# EAGLE design cyrf6936-bob (EAGLE 6.4)
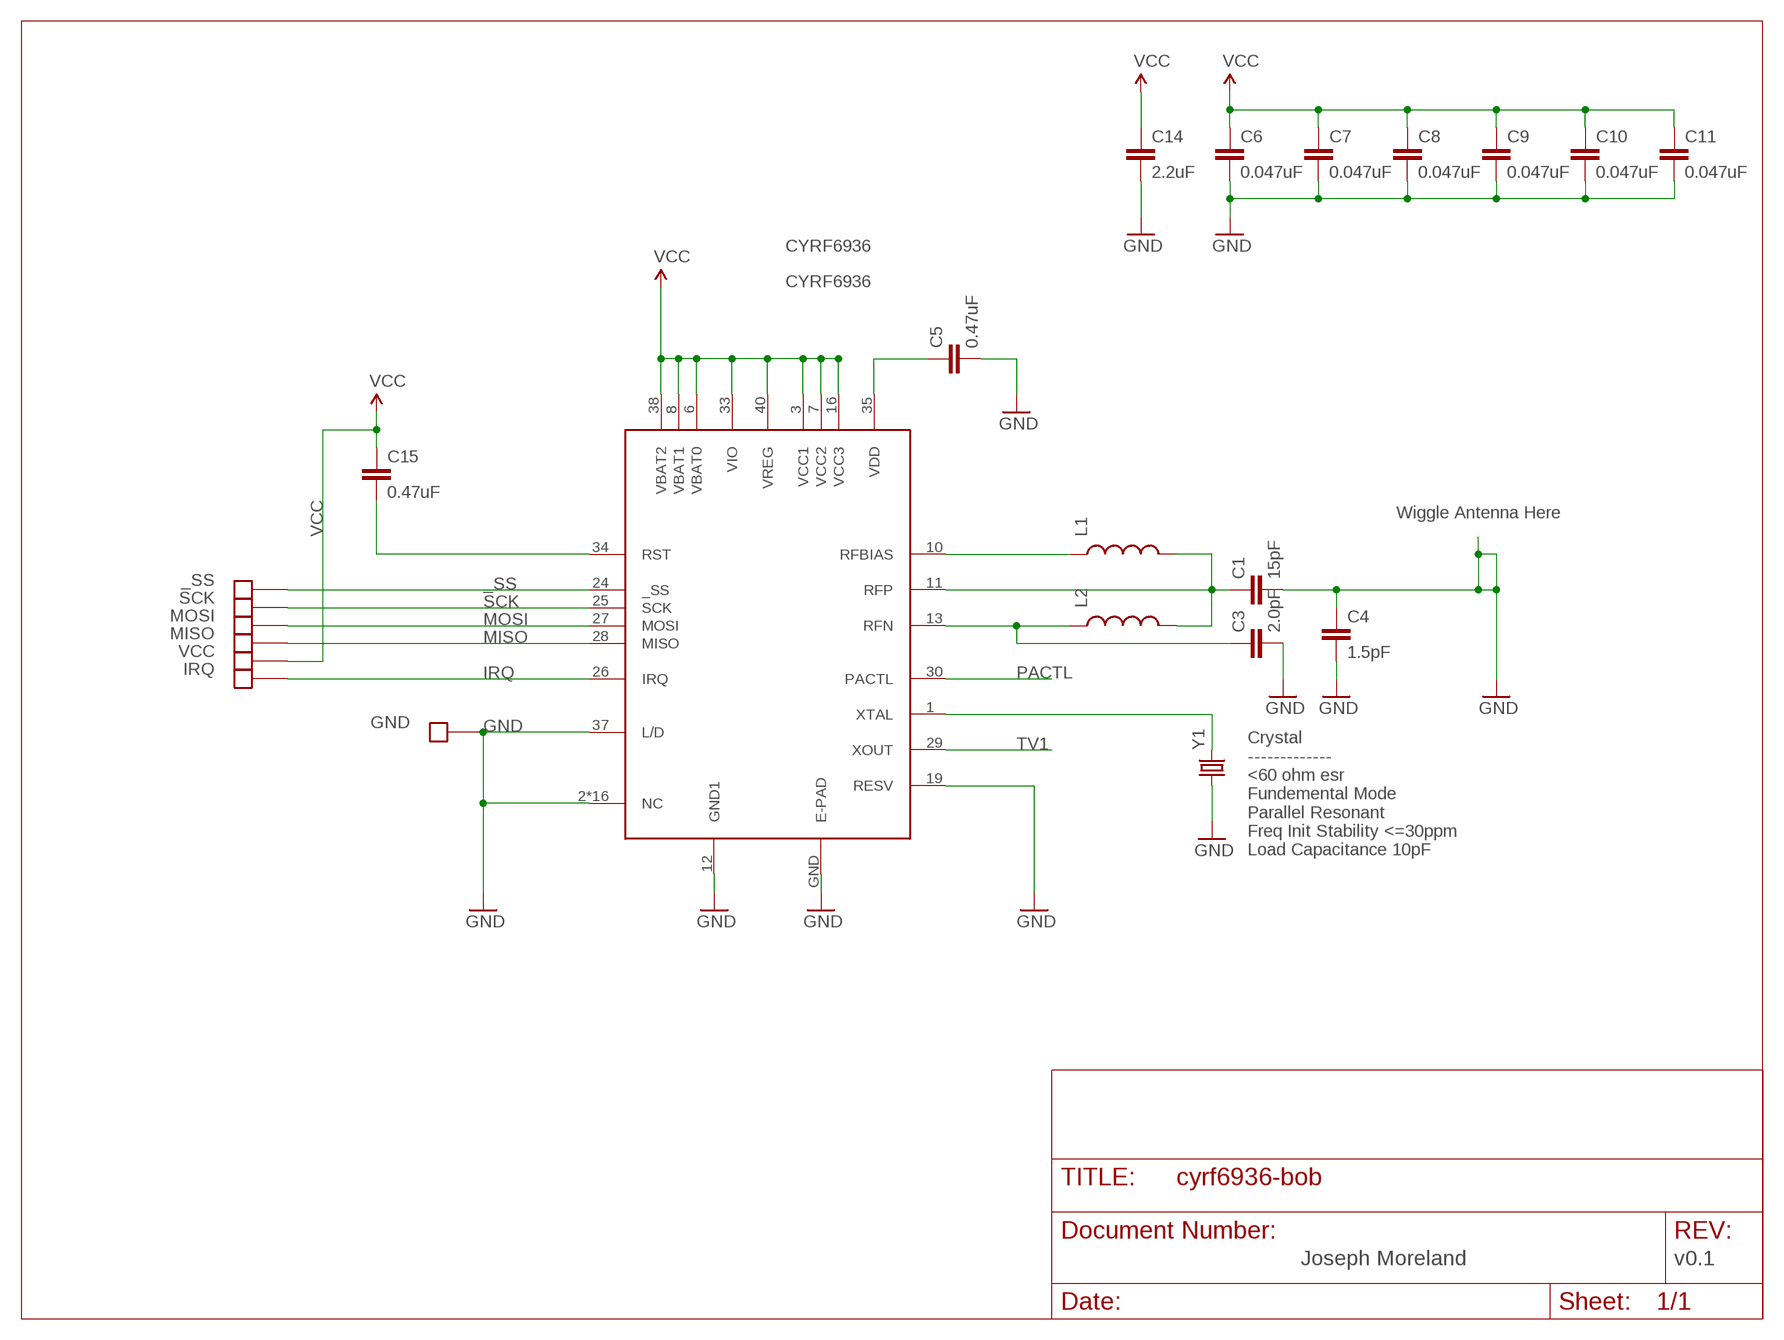
[diagram p0: schematic, sheet 1]

## Parts
_SS  SOLDER_PAD  [SOLDER_PAD]
C1  15pF  CAP0402-CAP  [0402-CAP]
C3  2.0pF  CAP0402-CAP  [0402-CAP]
C4  1.5pF  CAP0402-CAP  [0402-CAP]
C5  0.47uF  CAP0402-CAP  [0402-CAP]
C6  0.047uF  CAP0402-CAP  [0402-CAP]
C7  0.047uF  CAP0402-CAP  [0402-CAP]
C8  0.047uF  CAP0402-CAP  [0402-CAP]
C9  0.047uF  CAP0402-CAP  [0402-CAP]
C10  0.047uF  CAP0402-CAP  [0402-CAP]
C11  0.047uF  CAP0402-CAP  [0402-CAP]
C14  2.2uF  CAP0805  [0805]
C15  0.47uF  CAP0402-CAP  [0402-CAP]
CYRF6936  CYRF6936  [QFN40]
GND  SOLDER_PAD  [SOLDER_PAD]
IRQ  SOLDER_PAD  [SOLDER_PAD]
L1  INDUCTOR0603  [0603]
L2  INDUCTOR0402  [C0402]
MISO  SOLDER_PAD  [SOLDER_PAD]
MOSI  SOLDER_PAD  [SOLDER_PAD]
SCK  SOLDER_PAD  [SOLDER_PAD]
VCC  SOLDER_PAD  [SOLDER_PAD]
Y1  CRYSTAL5X3  [CRYSTAL-SMD-5X3]

## Nets
_SS: _SS.SPAD(NET) CYRF6936.24(_SS)
GND: C1.2 C3.2 C4.1 C4.2 C5.2 C6.2 C7.2 C8.2 C9.2 C10.2 C11.2 C14.2 CYRF6936.2(NC) CYRF6936.4(NC) CYRF6936.5(NC) CYRF6936.9(NC) CYRF6936.12(GND1) CYRF6936.14(NC) CYRF6936.15(NC) CYRF6936.17(NC) CYRF6936.18(NC) CYRF6936.19(RESV) CYRF6936.20(NC) CYRF6936.21(NC) CYRF6936.22(NC) CYRF6936.23(NC) CYRF6936.31(NC) CYRF6936.32(NC) CYRF6936.36(NC) CYRF6936.37(L/D) CYRF6936.39(NC) CYRF6936.GND(E-PAD) GND.SPAD(NET) Y1.1
IRQ: CYRF6936.26(IRQ) IRQ.SPAD(NET)
MISO: CYRF6936.28(MISO) MISO.SPAD(NET)
MOSI: CYRF6936.27(MOSI) MOSI.SPAD(NET)
N$2: CYRF6936.1(XTAL) Y1.3
PACTL: CYRF6936.30(PACTL)
RFBIAS: CYRF6936.10(RFBIAS) L1.1
RFN: C3.1 CYRF6936.13(RFN) L2.1
RFP: C1.1 CYRF6936.11(RFP) L1.2 L2.2
RST: C15.2 CYRF6936.34(RST)
SCK: CYRF6936.25(SCK) SCK.SPAD(NET)
TV1: CYRF6936.29(XOUT)
VCC: C6.1 C7.1 C8.1 C9.1 C10.1 C11.1 C14.1 C15.1 CYRF6936.3(VCC1) CYRF6936.6(VBAT0) CYRF6936.7(VCC2) CYRF6936.8(VBAT1) CYRF6936.16(VCC3) CYRF6936.33(VIO) CYRF6936.38(VBAT2) CYRF6936.40(VREG) VCC.SPAD(NET)
VDD: C5.1 CYRF6936.35(VDD)

## Notes on the sheet
- Wiggle Antenna Here
- Crystal
  -------------
  <60 ohm esr
  Fundemental Mode
  Parallel Resonant
  Freq Init Stability <=30ppm
  Load Capacitance 10pF
- Joseph Moreland | v0.1

## Library data of the parts
_SS GND IRQ MISO MOSI SCK VCC = JCM:SOLDER_PAD
C1 = SparkFun-Passives:CAP: Capacitor Standard 0603 ceramic capacitor, and 0.1" leaded capacitor.; PARTNO: C0402C150J5GACTU; VOLT: 50
C3 = SparkFun-Passives:CAP: Capacitor Standard 0603 ceramic capacitor, and 0.1" leaded capacitor.; PARTNO: C0402C209C5GACTU; VOLT: 50
C4 = SparkFun-Passives:CAP: Capacitor Standard 0603 ceramic capacitor, and 0.1" leaded capacitor.; PARTNO: C0402C159B5GACTU; VOLT: 50
C5 C15 = SparkFun-Passives:CAP: Capacitor Standard 0603 ceramic capacitor, and 0.1" leaded capacitor.; PARTNO: GRM155R60J474KE19D; VOLT: 6.3
C6-C11 = SparkFun-Passives:CAP: Capacitor Standard 0603 ceramic capacitor, and 0.1" leaded capacitor.; PARTNO: 0402YD473KAT2A
C14 = SparkFun-Passives:CAP: Capacitor Standard 0603 ceramic capacitor, and 0.1" leaded capacitor.; PARTNO: GRM21BR71A225KA01L
CYRF6936 = JCM:CYRF6936; PARTNO: CYRF6936B-40LTXC
L1 = SparkFun-Passives:INDUCTOR: Inductors Basic Inductor/Choke - 0603 and 1206. Footprints are not proven and vary greatly between part numbers.; PARTNO: ELJ-RE22NGFA
L2 = SparkFun-Passives:INDUCTOR: Inductors Basic Inductor/Choke - 0603 and 1206. Footprints are not proven and vary greatly between part numbers.; PARTNO: ELJ-RF1N8DFB
Y1 = SparkFun-FreqCtrl:CRYSTAL: Various standard crystals. Proven footprints. Spark Fun Electronics SKU : COM-00534; PARTNO: 7B-12.000MEEQ-T

## Board
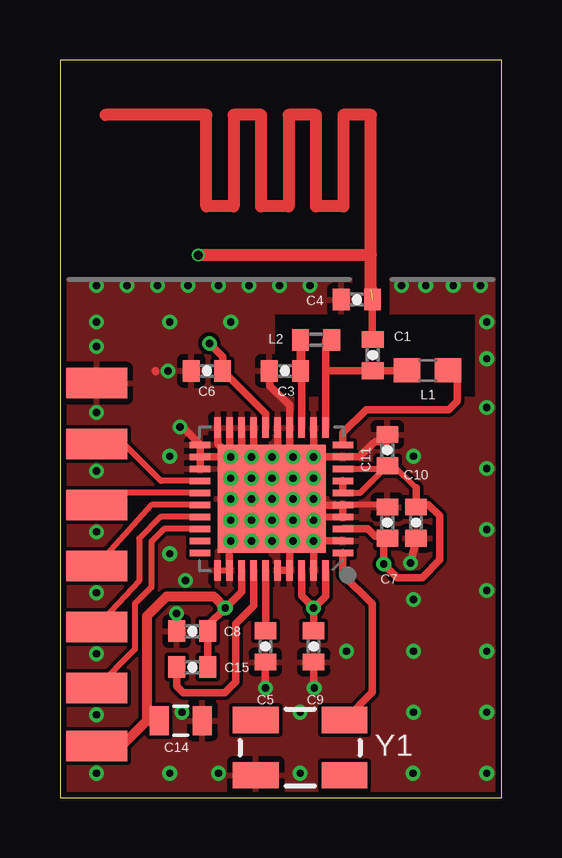
[diagram p1: board, top side]
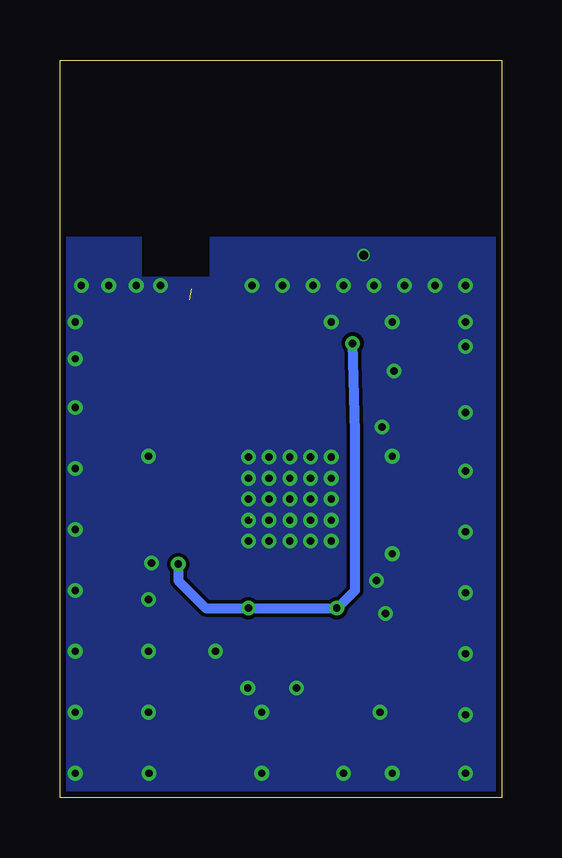
[diagram p2: board, bottom side, seen from below]

Size 18.41 x 30.73 mm. Coordinates in mm from the lower left corner, seen from the top.
Outline: 0,0 18.41,0 18.41,30.73 0,30.73 0,0
Copper layers (1*16): Top 0.035mm / dielectric 1.5mm / Bottom 0.035mm
Design rules "Fusion_eagle_rule_v1.1-JCM-restring *": minimum track width 6mil, minimum drill 12mil, track to track 6mil, track to pad 6mil, pad to pad 6mil, via to via 6mil, smd to smd 0mil, copper to edge 10mil, drill to drill 10mil, minimum pad ring 10mil, minimum via ring 2mil, stop-mask expansion 2mil, vias tented up to drill 100mil, thermal gap 10mil
tRestrict: area 9,16.7 to 17.3,20.1; area 12.2,20.1 to 13.7,21.8
bRestrict: area 12.2,21.7 to 15,23.4

### Footprints (pad centres in the part's own frame; a part is rotated, then mirrored left to right if it is on the bottom)
SOLDER_PAD = smd 2.54 x 1.27: SPAD 0,0
0402-CAP = smd 0.7 x 0.9: 1 -0.65,0; 2 0.65,0
0805 = smd 0.8 x 1.2: 1 -0.9,0; 2 0.9,0
QFN40 = smd 0.28 x 0.85: 1 -2.25,-2.975; 2 -1.75,-2.975; 3 -1.25,-2.975; 4 -0.75,-2.975; 5 -0.25,-2.975; 6 0.25,-2.975; 7 0.75,-2.975; 8 1.25,-2.975; 9 1.75,-2.975; 10 2.25,-2.975; 21 2.25,2.975; 22 1.75,2.975; 23 1.25,2.975; 24 0.75,2.975; 25 0.25,2.975; 26 -0.25,2.975; 27 -0.75,2.975; 28 -1.25,2.975; 29 -1.75,2.975; 30 -2.25,2.975 | smd 0.85 x 0.28: 11 2.975,-2.25; 12 2.975,-1.75; 13 2.975,-1.25; 14 2.975,-0.75; 15 2.975,-0.25; 16 2.975,0.25; 17 2.975,0.75; 18 2.975,1.25; 19 2.975,1.75; 20 2.975,2.25; 31 -2.975,2.25; 32 -2.975,1.75; 33 -2.975,1.25; 34 -2.975,0.75; 35 -2.975,0.25; 36 -2.975,-0.25; 37 -2.975,-0.75; 38 -2.975,-1.25; 39 -2.975,-1.75; 40 -2.975,-2.25 | smd 4.5 x 4.5: GND 0,0
0603 = smd 1.1 x 1: 1 -0.85,0; 2 0.85,0
C0402 = smd 0.7 x 0.9: 1 -0.65,0; 2 0.65,0
CRYSTAL-SMD-5X3 = smd 1.9 x 1.1: 1 -1.85,-1.15; 2 1.85,-1.15; 3 1.85,1.15; 4 -1.85,1.15

### Placement (x,y rotation side)
_SS  1.52,14.73 0 top
C1  13.03,18.44 90 top
C3  9.37,17.78 180 top
C4  12.37,20.75 180 top
C5  8.56,6.3 270 top
C6  6.12,17.78 180 top
C7  13.64,11.46 90 top
C8  5.51,6.93 180 top
C9  10.57,6.3 270 top
C10  14.83,11.46 270 top
C11  13.64,14.48 90 top
C14  5.03,3.2 0 top
C15  5.51,5.44 180 top
CYRF6936  8.81,12.45 90 top
GND  1.52,17.27 0 top
IRQ  1.52,9.65 0 top
L1  15.32,17.81 180 top
L2  10.67,19.08 0 top
MISO  1.52,4.57 0 top
MOSI  1.52,7.11 0 top
SCK  1.52,12.19 0 top
VCC  1.52,2.16 0 top
Y1  10.01,2.08 0 top

### Tracks (layer width: path | path; a pad name or v marks a point on that pad's centre or on a via)
_SS
  Top 0.254: CYRF6936.24 4.2,13.2 2.41,14.99
  Top 0.406: 2.41,14.99 _SS.SPAD
GND  (via drill 0.3 pad 0.61, 0.38 pad 0.51)  (2 unrouted)
  Top 0.254: CYRF6936.31 CYRF6936.32 | 7.06,11.94 8.06,11.94 8.06,12.45 | CYRF6936.5 11.8,12.21 | CYRF6936.5 | 10.44,11.71 10.44,12.45 CYRF6936.GND | C7.2 13.64,12.2 CYRF6936.5 | v10.57,10.7 v10.57,10.69 | CYRF6936.39 | 7.56,14.2 v7.98,14.2 | 7.06,14.2 v7.11,14.2 | 10.57,4.57 v10.59,4.57 | 8.56,4.72 v8.56,4.57 | 10.44,10.85 10.44,11.63
  Top 0.305: CYRF6936.17 8.06,12.45 | CYRF6936.32 7.06,11.94 | C10.2 v14.61,9.78 | CYRF6936.5 10.52,12.19 | CYRF6936.5 CYRF6936.4 10.44,11.71 | CYRF6936.2 v10.57,10.7 | CYRF6936.39 v10.57,10.69 | CYRF6936.18 7.56,14.2 | CYRF6936.19 7.06,14.2 | CYRF6936.20 6.56,14.75 v7.11,14.2 CYRF6936.22 CYRF6936.23 | CYRF6936.22 CYRF6936.21 5.09,15.44 v5,15.44 | C9.2 10.57,4.57 | C5.2 8.56,4.72 | v4.85,7.67 4.84,6.96 C8.2 | 3.99,17.75 3.96,17.78 | C3.2 8.74,17.77 8.74,17.17 9.56,16.34 CYRF6936.14 9.56,14.34 v9.7,14.2 | C1.2 C4.1 | C11.2 13.63,14.83 13.11,14.83 12.47,14.2 CYRF6936.9 v10.57,14.2 v10.56,14.2 CYRF6936.12 | CYRF6936.15 9.06,14.42 v8.84,14.2 | CYRF6936.36 CYRF6936.37 9.56,10.55 v9.7,10.69
  Top 0.406: 8.06,12.45 CYRF6936.GND
  Top 0.508: 12.95,21.21 12.95,22.61 | 12.95,22.61 12.95,28.45 11.81,28.45 11.81,24.64 10.67,24.64 10.67,28.45 9.52,28.45 9.52,24.64 8.38,24.64 8.38,28.45 7.24,28.45 7.24,24.64 6.1,24.64 6.1,28.45 1.9,28.45 | 12.95,22.61 v5.77,22.61
  other vias: 5.23,9.04 10.57,13.31 9.7,13.31 8.84,13.31 7.98,13.31 7.11,13.31 10.57,12.45 9.7,12.45 8.84,12.45 7.98,12.45 7.11,12.45 10.57,11.56 9.7,11.56 8.84,11.56 7.98,11.56 7.11,11.56 8.84,10.69 7.98,10.69 7.11,10.69 4.5,17.78 1.52,3.45 1.52,5.99 1.52,8.53 1.52,11.07 1.52,13.61 1.52,16.05 1.52,21.34 1.52,1.02 15.24,21.34 14.22,21.34 10.41,21.34 9.14,21.34 2.79,21.34 7.87,21.34 6.6,21.34 5.33,21.34 4.06,21.34 17.53,21.34 14.71,1.02 16.38,21.34 4.57,1.02 6.6,1.02 10.01,1.02 10.01,3.56 5.08,3.56 4.57,10.16 4.57,14.22 4.57,19.81 14.73,8.26 11.94,6.1 14.73,3.56 7.11,19.81 1.52,18.8 1.52,19.81 14.73,14.22 17.78,3.56 17.78,6.1 17.78,8.64 17.78,11.18 17.78,13.72 17.78,16.26 17.78,1.02 17.78,18.29 17.78,19.81 14.73,6.1
  pour Bottom: 0,0 18.41,0 18.41,23.32 0,23.32
  pour Top (rank 2): 0,0 18.41,0 18.41,21.59 0,21.59
IRQ
  Top 0.254: CYRF6936.26 3.81,12.2 IRQ.SPAD
MISO
  Top 0.254: CYRF6936.28 4.34,11.2 3.81,10.67 3.81,8.76 3.12,8.08 3.12,6.17 MISO.SPAD
MOSI
  Top 0.254: CYRF6936.27 4.2,11.7 3.3,10.8 3.3,9.02 MOSI.SPAD
N$2
  Top 0.305: CYRF6936.1 11.79,9.29 13,8.08 13,4.38 Y1.3
RFBIAS
  Top 0.305: CYRF6936.10 11.79,15.19 12.75,16.15 16.2,16.15 16.56,16.51 16.56,17.79 L1.1
RFN
  Top 0.305: 10.06,19.07 CYRF6936.13 | C3.1 L2.1
  Top 0.508: 10.06,19.07 L2.1
RFP
  Top 0.305: 11.06,19.07 11.06,18.92 | 11.06,18.92 11.06,17.79 | 11.06,17.79 CYRF6936.11 | C1.1 11.06,17.79 | C1.1 | L2.2 11.22,19.07 11.06,18.92 | C1.1 14.45,17.79 L1.2
RST
  Top 0.305: CYRF6936.34 8.06,7.99 7.31,7.24 7.31,4.83 6.86,4.37 5.13,4.37 4.86,4.64 C15.2
SCK
  Top 0.254: CYRF6936.25 1.77,12.7 SCK.SPAD
VCC  (via drill 0.3 pad 0.61)
  Top 0.254: 13.47,13.7 C11.1 | C7.1 13.63,10.9 13.49,10.9 | 15.35,12.21 C10.1 | C8.1 6.16,7.18 | CYRF6936.6 12.51,12.7 C11.1 | CYRF6936.8 13.51,13.7 C11.1 | 14.83,12.9 13.91,13.83 C11.1
  Top 0.305: CYRF6936.40 11.06,8.4 v10.57,7.9 | C9.1 v10.57,7.9 | CYRF6936.7 CYRF6936.6 | CYRF6936.3 12.83,11.2 13.13,10.9 13.49,10.9 v13.49,9.73 14.05,9.17 15.09,9.17 15.82,9.91 15.82,11.73 15.35,12.21 | C10.1 14.83,12.9 | CYRF6936.33 7.56,8.58 v6.88,7.9 6.16,7.18 | C15.1 C8.1 | CYRF6936.16 8.56,15.99 C6.1 6.77,18.38 v6.22,18.92 | CYRF6936.38 10.06,8.4 v10.57,7.9 | VCC.SPAD 2.58,2.16
  Top 0.406: v6.88,7.9 6.4,8.38 4.45,8.38 3.62,7.56 3.62,3.2 | 3.62,3.2 2.58,2.16 | 3.62,3.2 C14.1
  Bottom 0.406: v13.49,9.73 13.49,9.04 12.34,7.9 v10.57,7.9 v6.88,7.9 6.86,7.9 6.12,8.64 6.12,15.21 v6.22,18.92
VDD
  Top 0.254: C5.1
  Top 0.305: CYRF6936.35 C5.1

### Text on the board
tDocu: CYRF6936-BoB v0.1
bDocu: J Moreland Engineering LLC / 18 Apr 2013